# EAGLE design open-bldc (EAGLE 5.03)
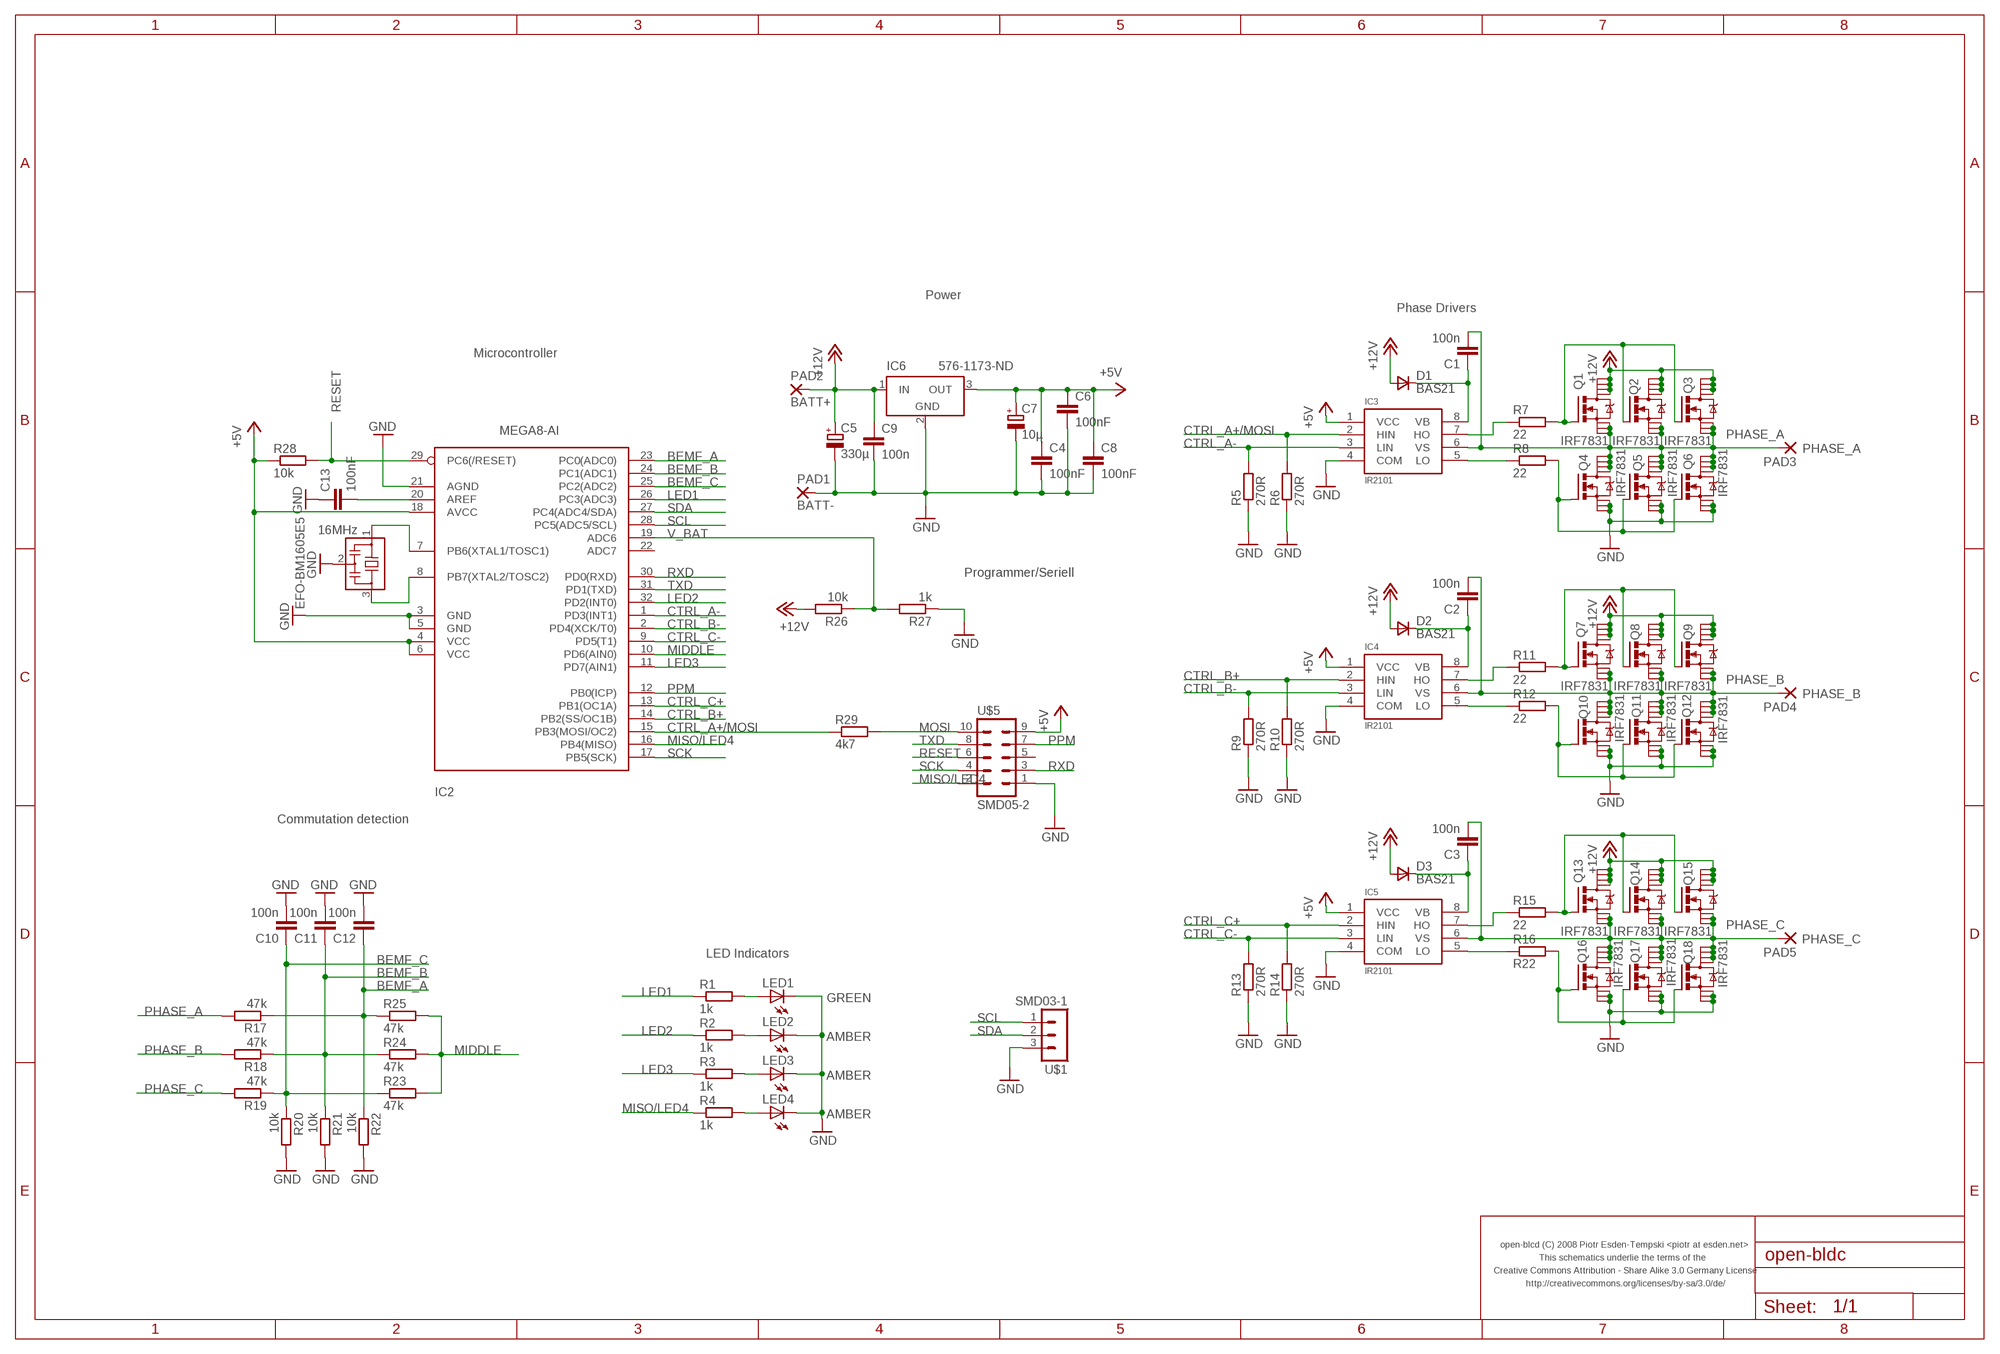
[diagram p0: schematic, sheet 1]

## Parts
C1  100n  C-EUC0603  [C0603]
C2  100n  C-EUC0603  [C0603]
C3  100n  C-EUC0603  [C0603]
C4  100nF  C-EUC0603  [C0603]
C5  330µ  CPOL-EUE3.5-8  [E3,5-8]
C6  100nF  C-EUC0603  [C0603]
C7  10µ  CPOL-EUD/7343-31R  [D/7343-31R]
C8  100nF  C-EUC0603  [C0603]
C9  100n  C-EUC0603  [C0603]
C10  100n  C-EUC0603  [C0603]
C11  100n  C-EUC0603  [C0603]
C12  100n  C-EUC0603  [C0603]
C13  100nF  C-EUC0603  [C0603]
D1  BAS21  VAR2SOT23  [SOT-23]
D2  BAS21  VAR2SOT23  [SOT-23]
D3  BAS21  VAR2SOT23  [SOT-23]
EFO-BM1605E5  16MHz  EFOBM  [EFOBM]
IC2  MEGA8-AI  [TQFP32-08]
IC3  IR2101  [SO-8]
IC4  IR2101  [SO-8]
IC5  IR2101  [SO-8]
IC6  576-1173-ND  LT1129CST5  [SOT223]
LED1  GREEN  LEDCHIP-LED0603  [CHIP-LED0603]
LED2  AMBER  LEDCHIP-LED0603  [CHIP-LED0603]
LED3  AMBER  LEDCHIP-LED0603  [CHIP-LED0603]
LED4  AMBER  LEDCHIP-LED0603  [CHIP-LED0603]
PAD1  BATT-  SMD5  [SMD2,54-5,08]
PAD2  BATT+  SMD5  [SMD2,54-5,08]
PAD3  PHASE_A  SMD5  [SMD2,54-5,08]
PAD4  PHASE_B  SMD5  [SMD2,54-5,08]
PAD5  PHASE_C  SMD5  [SMD2,54-5,08]
Q1  IRF7831  N-MOSFET-SO8S  [SO-08]
Q2  IRF7831  N-MOSFET-SO8S  [SO-08]
Q3  IRF7831  N-MOSFET-SO8S  [SO-08]
Q4  IRF7831  N-MOSFET-SO8S  [SO-08]
Q5  IRF7831  N-MOSFET-SO8S  [SO-08]
Q6  IRF7831  N-MOSFET-SO8S  [SO-08]
Q7  IRF7831  N-MOSFET-SO8S  [SO-08]
Q8  IRF7831  N-MOSFET-SO8S  [SO-08]
Q9  IRF7831  N-MOSFET-SO8S  [SO-08]
Q10  IRF7831  N-MOSFET-SO8S  [SO-08]
Q11  IRF7831  N-MOSFET-SO8S  [SO-08]
Q12  IRF7831  N-MOSFET-SO8S  [SO-08]
Q13  IRF7831  N-MOSFET-SO8S  [SO-08]
Q14  IRF7831  N-MOSFET-SO8S  [SO-08]
Q15  IRF7831  N-MOSFET-SO8S  [SO-08]
Q16  IRF7831  N-MOSFET-SO8S  [SO-08]
Q17  IRF7831  N-MOSFET-SO8S  [SO-08]
Q18  IRF7831  N-MOSFET-SO8S  [SO-08]
R1  1k  R-EU_R0603  [R0603]
R2  1k  R-EU_R0603  [R0603]
R3  1k  R-EU_R0603  [R0603]
R4  1k  R-EU_R0603  [R0603]
R5  270R  R-EU_R0603  [R0603]
R6  270R  R-EU_R0603  [R0603]
R7  22  R-EU_R0603  [R0603]
R8  22  R-EU_R0603  [R0603]
R9  270R  R-EU_R0603  [R0603]
R10  270R  R-EU_R0603  [R0603]
R11  22  R-EU_R0603  [R0603]
R12  22  R-EU_R0603  [R0603]
R13  270R  R-EU_R0603  [R0603]
R14  270R  R-EU_R0603  [R0603]
R15  22  R-EU_R0603  [R0603]
R16  R22  R-EU_R0603  [R0603]
R17  47k  R-EU_R0603  [R0603]
R18  47k  R-EU_R0603  [R0603]
R19  47k  R-EU_R0603  [R0603]
R20  10k  R-EU_R0603  [R0603]
R21  10k  R-EU_R0603  [R0603]
R22  10k  R-EU_R0603  [R0603]
R23  47k  R-EU_R0603  [R0603]
R24  47k  R-EU_R0603  [R0603]
R25  47k  R-EU_R0603  [R0603]
R26  10k  R-EU_R0603  [R0603]
R27  1k  R-EU_R0603  [R0603]
R28  10k  R-EU_R0603  [R0603]
R29  4k7  R-EU_R0603  [R0603]
U$1  SMD03-1  [SMD03-1]
U$5  SMD05-2  [SMD05-2]

## Nets
+5V: C4.1 C6.1 C7.+ C8.1 IC2.4(VCC) IC2.6(VCC) IC2.18(AVCC) IC3.1(VCC) IC4.1(VCC) IC5.1(VCC) IC6.3(OUT) R28.1 U$5.9
+12V: C5.+ C9.1 D1.3(A) D2.3(A) D3.3(A) IC6.1(IN) PAD2.1(P) Q1.5(D) Q1.6(D) Q1.7(D) Q1.8(D) Q2.5(D) Q2.6(D) Q2.7(D) Q2.8(D) Q3.5(D) Q3.6(D) Q3.7(D) Q3.8(D) Q7.5(D) Q7.6(D) Q7.7(D) Q7.8(D) Q8.5(D) Q8.6(D) Q8.7(D) Q8.8(D) Q9.5(D) Q9.6(D) Q9.7(D) Q9.8(D) Q13.5(D) Q13.6(D) Q13.7(D) Q13.8(D) Q14.5(D) Q14.6(D) Q14.7(D) Q14.8(D) Q15.5(D) Q15.6(D) Q15.7(D) Q15.8(D) R26.2
BEMF_A: C12.1 IC2.23(PC0(ADC0)) R17.1 R22.1 R25.1
BEMF_B: C11.1 IC2.24(PC1(ADC1)) R18.1 R21.1 R24.1
BEMF_C: C10.1 IC2.25(PC2(ADC2)) R19.1 R20.1 R23.1
CTRL_A+/MOSI: IC2.15(PB3(MOSI/OC2)) IC3.2(HIN) R6.2 R29.1
CTRL_A-: IC2.1(PD3(INT1)) IC3.3(LIN) R5.2
CTRL_B+: IC2.14(PB2(SS/OC1B)) IC4.2(HIN) R10.2
CTRL_B-: IC2.2(PD4(XCK/T0)) IC4.3(LIN) R9.2
CTRL_C+: IC2.13(PB1(OC1A)) IC5.2(HIN) R14.2
CTRL_C-: IC2.9(PD5(T1)) IC5.3(LIN) R13.2
GND: C4.2 C5.- C6.2 C7.- C8.2 C9.2 C10.2 C11.2 C12.2 C13.1 EFO-BM1605E5.2 IC2.3(GND) IC2.5(GND) IC2.21(AGND) IC3.4(COM) IC4.4(COM) IC5.4(COM) IC6.2(GND) LED1.C LED2.C LED3.C LED4.C PAD1.1(P) Q4.1(S) Q4.2(S) Q4.3(S) Q5.1(S) Q5.2(S) Q5.3(S) Q6.1(S) Q6.2(S) Q6.3(S) Q10.1(S) Q10.2(S) Q10.3(S) Q11.1(S) Q11.2(S) Q11.3(S) Q12.1(S) Q12.2(S) Q12.3(S) Q16.1(S) Q16.2(S) Q16.3(S) Q17.1(S) Q17.2(S) Q17.3(S) Q18.1(S) Q18.2(S) Q18.3(S) R5.1 R6.1 R9.1 R10.1 R13.1 R14.1 R20.2 R21.2 R22.2 R27.1 U$1.3 U$5.1
LED1: IC2.26(PC3(ADC3)) R1.1
LED2: IC2.32(PD2(INT0)) R2.1
LED3: IC2.11(PD7(AIN1)) R3.1
MIDDLE: IC2.10(PD6(AIN0)) R23.2 R24.2 R25.2
MISO/LED4: IC2.16(PB4(MISO)) R4.1 U$5.2
MOSI: R29.2 U$5.10
N$1: IC4.7(HO) R11.1
N$2: IC3.7(HO) R7.1
N$3: LED1.A R1.2
N$4: LED2.A R2.2
N$5: LED3.A R3.2
N$6: C13.2 IC2.20(AREF)
N$7: IC3.5(LO) R8.1
N$8: EFO-BM1605E5.1 IC2.7(PB6(XTAL1/TOSC1))
N$9: EFO-BM1605E5.3 IC2.8(PB7(XTAL2/TOSC2))
N$10: LED4.A R4.2
N$11: Q1.4(G) Q2.4(G) Q3.4(G) R7.2
N$12: C1.1 D1.1(C) IC3.8(VB)
N$13: IC4.5(LO) R12.1
N$14: Q7.4(G) Q8.4(G) Q9.4(G) R11.2
N$15: Q4.4(G) Q5.4(G) Q6.4(G) R8.2
N$16: C2.1 D2.1(C) IC4.8(VB)
N$17: Q10.4(G) Q11.4(G) Q12.4(G) R12.2
N$18: IC5.7(HO) R15.1
N$19: IC5.5(LO) R16.1
N$20: Q13.4(G) Q14.4(G) Q15.4(G) R15.2
N$21: C3.1 D3.1(C) IC5.8(VB)
N$22: Q16.4(G) Q17.4(G) Q18.4(G) R16.2
PHASE_A: C1.2 IC3.6(VS) PAD3.1(P) Q1.1(S) Q1.2(S) Q1.3(S) Q2.1(S) Q2.2(S) Q2.3(S) Q3.1(S) Q3.2(S) Q3.3(S) Q4.5(D) Q4.6(D) Q4.7(D) Q4.8(D) Q5.5(D) Q5.6(D) Q5.7(D) Q5.8(D) Q6.5(D) Q6.6(D) Q6.7(D) Q6.8(D) R17.2
PHASE_B: C2.2 IC4.6(VS) PAD4.1(P) Q7.1(S) Q7.2(S) Q7.3(S) Q8.1(S) Q8.2(S) Q8.3(S) Q9.1(S) Q9.2(S) Q9.3(S) Q10.5(D) Q10.6(D) Q10.7(D) Q10.8(D) Q11.5(D) Q11.6(D) Q11.7(D) Q11.8(D) Q12.5(D) Q12.6(D) Q12.7(D) Q12.8(D) R18.2
PHASE_C: C3.2 IC5.6(VS) PAD5.1(P) Q13.1(S) Q13.2(S) Q13.3(S) Q14.1(S) Q14.2(S) Q14.3(S) Q15.1(S) Q15.2(S) Q15.3(S) Q16.5(D) Q16.6(D) Q16.7(D) Q16.8(D) Q17.5(D) Q17.6(D) Q17.7(D) Q17.8(D) Q18.5(D) Q18.6(D) Q18.7(D) Q18.8(D) R19.2
PPM: IC2.12(PB0(ICP)) U$5.7
RESET: IC2.29(PC6(/RESET)) R28.2 U$5.6
RXD: IC2.30(PD0(RXD)) U$5.3
SCK: IC2.17(PB5(SCK)) U$5.4
SCL: IC2.28(PC5(ADC5/SCL)) U$1.1
SDA: IC2.27(PC4(ADC4/SDA)) U$1.2
TXD: IC2.31(PD1(TXD)) U$5.8
V_BAT: IC2.19(ADC6) R26.1 R27.2
Unconnected: IC2.22(ADC7) U$5.5

## Notes on the sheet
- Power
- Phase Drivers
- Microcontroller
- Programmer/Seriell
- Commutation detection
- LED Indicators
- open-blcd (C) 2008 Piotr Esden-Tempski <piotr at esden.net>
- This schematics underlie the terms of the
- Creative Commons Attribution - Share Alike 3.0 Germany License
- http://creativecommons.org/licenses/by-sa/3.0/de/

## Power pins joined to a net without a drawn wire
GND: IC6.4(GND)

## Library data of the parts
C1-C4 C6 C8-C13 = rcl:C-EU: CAPACITOR, European symbol
C5 C7 = rcl:CPOL-EU: POLARIZED CAPACITOR, European symbol
D1-D3 = zetex:VAR2SOT23: DIODE
EFO-BM1605E5 = open-bldc:EFOBM
IC2 = atmel:MEGA8: MICROCONTROLLER 8 Kbytes FLASH, 1 kbytes SRAM, 512 bytes EEPROM, USART, 6-channel 10 bit ADC, 2-channel 8 bit ADC Pin compatible with Atmega48, ATMega88, ATMega168 Source: avr.lbr
IC3-IC5 = open-bldc:IR2101
IC6 = linear-technology:LT1129CST5: VOLTAGE REGULATOR with shutdown
LED1-LED4 = led:LED: LED OSRAM: - CHIPLED LG R971, LG N971, LY N971, LG Q971, LY Q971, LO R971, LY R971 LH N974, LH R974 LS Q976, LO Q976, LY Q976 LO Q996 - Hyper CHIPLED LW Q18S LB Q993, LB Q99A, LB R99A - SideLED LS A670, LO A670, LY A670, LG A670, LP A670 LB A673, LV A673, LT A673, LW A673 LH A674 LY A675 LS A676, LA A676, LO A676, LY A676, LW A676 LS A679, LY A679, LG A679 - Hyper Micro SIDELED® LS Y876, LA Y876, LO Y876, LY Y876 LT Y87S - SmartLED LW L88C, LW L88S LB L89C, LB L89S, LG L890 LS L89K, LO L89K, LY L89K LS L896, LA L896, LO L896, LY L896 - TOPLED LS T670, LO T670, LY T670, LG T670, LP T670 LSG T670, LSP T670, LSY T670, LOP T670, LYG T670 LG T671, LOG T671, LSG T671 LB T673, LV T673, LT T673, LW T673 LH T674 LS T676, LA T676, LO T676, LY T676, LB T676, LH T676, LSB T676, LW T676 LB T67C, LV T67C, LT T67C, LS T67K, LO T67K, LY T67K, LW E67C LS E67B, LA E67B, LO E67B, LY E67B, LB E67C, LV E67C, LT E67C LW T67C LS T679, LY T679, LG T679 LS T770, LO T770, LY T770, LG T770, LP T770 LB T773, LV T773, LT T773, LW T773 LH T774 LS E675, LA E675, LY E675, LS T675 LS T776, LA T776, LO T776, LY T776, LB T776 LHGB T686 LT T68C, LB T68C - Hyper Mini TOPLED® LB M676 - Mini TOPLED Santana® LG M470 LS M47K, LO M47K, LY M47K Source: http://www.osram.convergy.de LUXEON: - LUMILED® LXK2-PW12-R00, LXK2-PW12-S00, LXK2-PW14-U00, LXK2-PW14-V00 LXK2-PM12-R00, LXK2-PM12-S00, LXK2-PM14-U00 LXK2-PE12-Q00, LXK2-PE12-R00, LXK2-PE12-S00, LXK2-PE14-T00, LXK2-PE14-U00 LXK2-PB12-K00, LXK2-PB12-L00, LXK2-PB12-M00, LXK2-PB14-N00, LXK2-PB14-P00, LXK2-PB14-Q00 LXK2-PR12-L00, LXK2-PR12-M00, LXK2-PR14-Q00, LXK2-PR14-R00 LXK2-PD12-Q00, LXK2-PD12-R00, LXK2-PD12-S00 LXK2-PH12-R00, LXK2-PH12-S00 LXK2-PL12-P00, LXK2-PL12-Q00, LXK2-PL12-R00 Source: www.luxeon.com KINGBRIGHT: KA-3528ASYC Source: www.kingbright.com
PAD1-PAD5 = wirepad:SMD5: SMD PAD
Q1-Q18 = my-transistor-power:N-MOSFET-SO8: N-Channel MOSFET Example: FDS7760A; N-Channel Logic Level PowerTrench® MOSFET FDS2572; N-Channel UltraFET® Trench MOSFET Source: www.fairchildsemi.com
R1-R29 = rcl:R-EU_: RESISTOR, European symbol
U$1 = patrick:SMD03-1
U$5 = patrick:SMD05-2

## Net classes
0 default: width 0.152 mm, drill 0.305 mm, clearance 0.152 mm

## Board
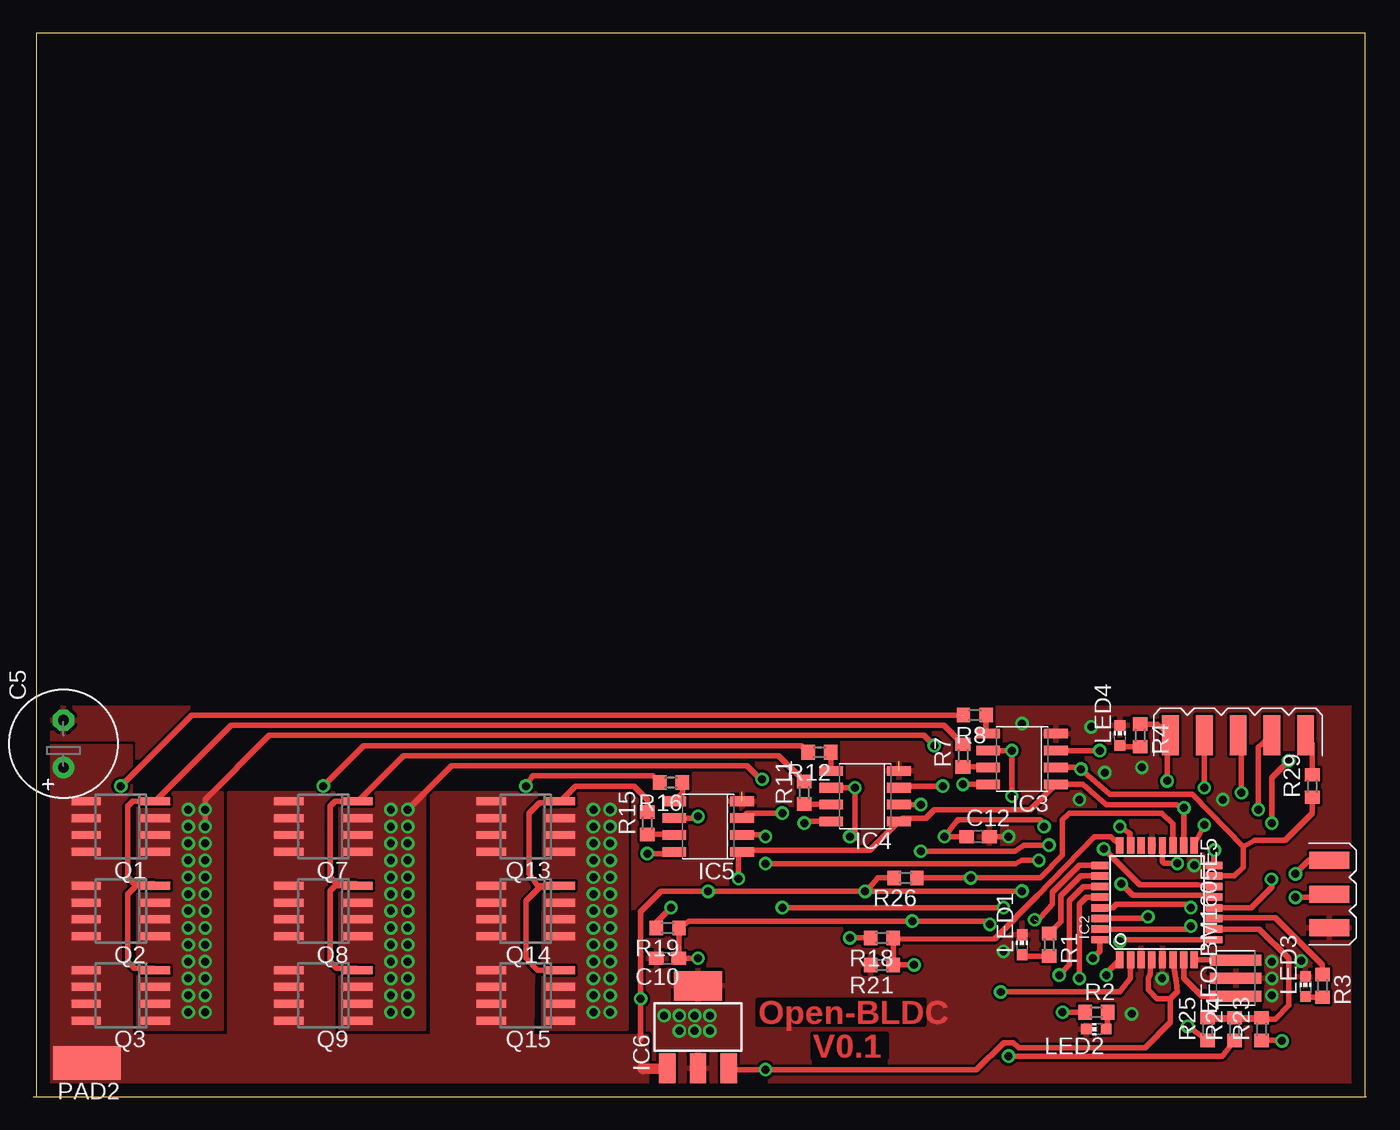
[diagram p1: board, top side]
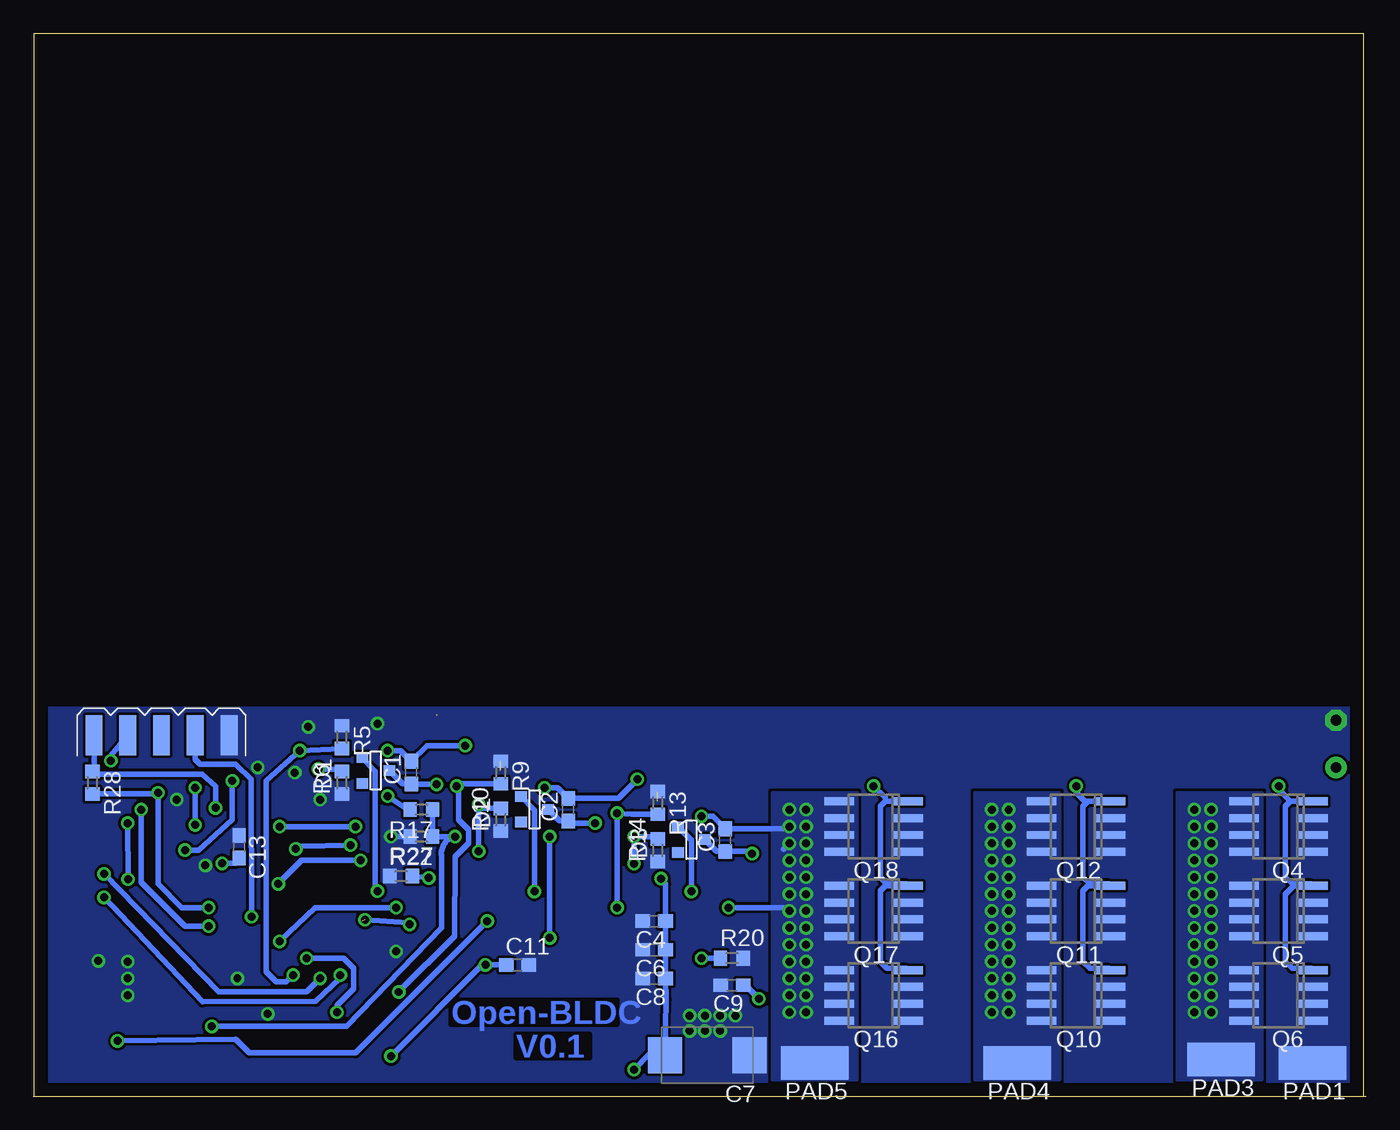
[diagram p2: board, bottom side, seen from below]

Size 100.32 x 80 mm. Coordinates in mm from the lower left corner, seen from the top.
Outline: 100.24,0 100.24,80 0.24,80 0.24,0
Outline: 0,0 100.32,0
Copper layers (1*16): Top 0.035mm / dielectric 1.5mm / Bottom 0.035mm
Design rules "default *": minimum track width 10mil, minimum drill 23mil, track to track 8mil, track to pad 8mil, pad to pad 8mil, via to via 8mil, smd to smd 8mil, copper to edge 40mil, drill to drill 8mil, minimum pad ring 10mil, minimum via ring 8mil, stop-mask expansion 0mil, vias tented up to drill 0mil, thermal gap 10mil

### Footprints (pad centres in the part's own frame; a part is rotated, then mirrored left to right if it is on the bottom)
C0603 = smd 1.1 x 1: 1 -0.85,0; 2 0.85,0
E3,5-8 = drill 0.813 pad 1.6 round: + -1.778,0 | drill 0.813 pad 1.6 octagon: - 1.778,0
D/7343-31R = smd 2.55 x 2.7: + 3.175,0; - -3.175,0
SOT-23 = smd 0.787 x 0.889: 1 0.025,-1.016; 2 -0.94,1.016; 3 0.991,1.016
EFOBM = smd 0.8 x 3.9: 1 0.7,1.45; 2 2.05,1.45; 3 3.4,1.45
TQFP32-08 = smd 1.27 x 0.559: 1 -4.293,2.8; 2 -4.293,2; 3 -4.293,1.2; 4 -4.293,0.4; 5 -4.293,-0.4; 6 -4.293,-1.2; 7 -4.293,-2; 8 -4.293,-2.8; 17 4.293,-2.8; 18 4.293,-2; 19 4.293,-1.2; 20 4.293,-0.4; 21 4.293,0.4; 22 4.293,1.2; 23 4.293,2; 24 4.293,2.8 | smd 0.559 x 1.27: 9 -2.8,-4.293; 10 -2,-4.293; 11 -1.2,-4.293; 12 -0.4,-4.293; 13 0.4,-4.293; 14 1.2,-4.293; 15 2,-4.293; 16 2.8,-4.293; 25 2.8,4.293; 26 2,4.293; 27 1.2,4.293; 28 0.4,4.293; 29 -0.4,4.293; 30 -1.2,4.293; 31 -2,4.293; 32 -2.8,4.293
SO-8 = smd 0.72 x 1.78: 1 -1.905,-2.543; 2 -0.635,-2.543; 3 0.635,-2.543; 4 1.905,-2.543; 5 1.905,2.543; 6 0.635,2.543; 7 -0.635,2.543; 8 -1.905,2.543
SOT223 = smd 1.219 x 2.235: 1 -2.311,-3.099; 2 0,-3.099; 3 2.311,-3.099 | smd 3.6 x 2.2: 4 0,3.099
CHIP-LED0603 = smd 0.8 x 0.8: A 0,-0.75; C 0,0.75
SMD2,54-5,08 = smd 2.54 x 5.08: 1 0,0
SO-08 = smd 0.6 x 2.2: 1 -1.905,-2.6; 2 -0.635,-2.6; 3 0.635,-2.6; 4 1.905,-2.6; 5 1.905,2.6; 6 0.635,2.6; 7 -0.635,2.6; 8 -1.905,2.6
R0603 = smd 1 x 1.1: 1 -0.85,0; 2 0.85,0
SMD03-1 = smd 1.27 x 3: 1 1.27,1.524; 2 3.81,1.524; 3 6.35,1.524
SMD05-2 = smd 1.27 x 3 bottom: 1 1.27,1.524; 3 3.81,1.524; 5 6.35,1.524; 7 8.89,1.524; 9 11.43,1.524 | smd 1.27 x 3: 2 1.27,1.524; 4 3.81,1.524; 6 6.35,1.524; 8 8.89,1.524; 10 11.43,1.524

### Placement (x,y rotation side)
C1  71.87,24.38 90 bottom
C2  60.06,21.59 90 bottom
C3  48.25,19.3 90 bottom
C4  53.58,13.21 180 bottom
C5  2.28,26.54 90 top
C6  53.58,11.05 180 bottom
C7  49.6,3.12 180 bottom
C8  53.58,8.89 180 bottom
C9  47.74,8.38 180 bottom
C10  47.74,10.41 180 top
C11  63.87,9.91 0 bottom
C12  71.11,19.56 0 top
C13  84.83,18.8 270 bottom
D1  74.54,24.51 90 bottom
D2  62.6,21.59 90 bottom
D3  50.79,19.3 90 bottom
EFO-BM1605E5  91.94,6.86 90 top
IC2  84.57,14.61 90 top
IC3  74.41,25.4 90 top
IC4  62.6,22.61 90 top
IC5  50.79,20.32 90 top
IC6  50.03,5.23 0 top
LED1  74.41,11.43 0 top
LED2  80,5.08 90 top
LED3  95.75,8.28 0 top
LED4  81.78,27.18 0 top
PAD1  4.05,2.54 90 bottom
PAD2  4.05,2.54 90 top
PAD3  10.91,2.79 90 bottom
PAD4  26.28,2.54 90 bottom
PAD5  41.52,2.54 90 bottom
Q1  6.59,20.32 90 top
Q2  6.59,13.97 90 top
Q3  6.59,7.62 90 top
Q4  6.59,20.32 90 bottom
Q5  6.59,13.97 90 bottom
Q6  6.59,7.62 90 bottom
Q7  21.83,20.32 90 top
Q8  21.83,13.97 90 top
Q9  21.83,7.62 90 top
Q10  21.83,7.62 90 bottom
Q11  21.83,13.97 90 bottom
Q12  21.83,20.32 90 bottom
Q13  37.07,20.32 90 top
Q14  37.07,13.97 90 top
Q15  37.07,7.62 90 top
Q16  37.07,7.62 90 bottom
Q17  37.07,13.97 90 bottom
Q18  37.07,20.32 90 bottom
R1  76.44,11.43 270 top
R2  80,6.35 0 top
R3  97.02,8.33 270 top
R4  83.3,27.18 270 top
R5  77.08,27.05 270 bottom
R6  77.08,23.62 90 bottom
R7  69.97,25.65 90 top
R8  70.86,28.7 180 top
R9  65.14,24.38 270 bottom
R10  65.14,20.83 90 bottom
R11  58.03,22.86 90 top
R12  59.17,25.91 180 top
R13  53.33,22.1 270 bottom
R14  53.33,18.54 90 bottom
R15  46.22,20.57 90 top
R16  48,23.62 180 top
R17  71.11,21.59 180 bottom
R18  63.87,11.94 180 top
R19  47.74,12.7 180 top
R20  47.74,10.41 0 bottom
R21  63.87,9.91 180 top
R22  71.11,19.56 180 bottom
R23  92.45,5.08 90 top
R24  90.41,5.08 90 top
R25  88.38,5.08 90 top
R26  65.65,16.46 180 top
R27  72.63,16.59 0 bottom
R28  95.88,23.62 270 bottom
R29  96.26,23.37 90 top
U$1  96,19.05 270 top
U$5  84.32,25.65 0 top

### Tracks (layer width: path | path; a pad name or v marks a point on that pad's centre or on a via)
+5V  (via drill 0.6)
  Top 0.406: IC2.18 86.6,18.93 v86.6,21.72 85.97,21.97 80.76,21.97 78.98,23.5 IC3.1 75.05,21.59 67.81,21.59 67.17,20.95 65.39,20.95 IC4.1 62.98,18.54 53.46,18.54 IC5.1 53.08,18.16 v53.08,16.41 | IC2.6 85.87,9.49 86.02,8.64 86.1,7.87 85.59,7.37 | IC2.4 84.06,10.2 84.06,9.27 83.91,8.87 83.91,8.05 84.57,7.37 85.59,7.37 | IC6.3 52.42,2.03 v55.11,2.03 70.98,2.03 73.04,4.06 73.78,4.06 74.18,3.68 83.68,3.68 85.59,5.59 85.59,7.37
  Bottom 0.406: v86.6,21.72 86.6,23.37 87.62,24.26 95.49,24.26 95.75,24.38 | 95.75,24.38 U$5.9 | v55.11,2.03 53.96,3.17 C7.+ 52.7,7.33 C8.1 C6.1 C4.1 52.73,16.01 52.82,16.13 v53.08,16.41 | 95.75,24.38 95.79,24.38 R28.1
+12V  (via drill 0.6)
  Top 0.406: 45.71,4.32 v45.71,7.37 45.71,13.92 47.23,15.44 v50.79,15.44 v62.6,15.44 | v62.6,15.44 v74.41,15.47 | 45.89,2.11 45.71,2.29 | v62.6,15.44 62.89,15.49 62.89,15.66 63.57,16.46 R26.2
  Top 0.813: 45.89,2.11 IC6.1
  Bottom 0.406: D3.3 50.79,19.28 v50.79,15.44 | D2.3 62.6,21.57 v62.6,15.44 62.6,15.11 | D1.3 74.59,24.49 74.59,15.62 v74.41,15.47 | C9.1 46.73,8.38 v45.71,7.37
  pour Top (no thermals): 37.84,22.86 29.96,22.86 29.96,4.57 22.6,4.57 22.6,22.86 14.72,22.86 14.72,4.57 7.36,4.57 7.36,26.42 0.24,26.42 0.24,0 46.22,0 46.22,4.57 37.58,4.57
BEMF_A  (via drill 0.6)
  Top 0.406: C12.1 v68.57,19.56 69.59,20.83 75.81,20.83 v76.06,20.32 | IC2.23 82.54,18.93 82.54,19.81 v81.78,20.32 | R25.1 88.34,4.23 v86.88,5.28
  Bottom 0.406: R17.1 C12.1 v68.57,19.56 arc-90 69.59,18.03 69.59,12.7 76.72,5.31 v86.88,5.28 | v76.06,20.32 v81.78,20.32
BEMF_B  (via drill 0.6)
  Top 0.406: v66.28,9.91 C11.1 R18.1 64.73,11.92 64.73,11.84 72.36,11.86 75.56,15.11 79.87,19.56 81.11,19.56 IC2.24 | R24.1 89.49,3.05 v73.4,3.05
  Bottom 0.406: C11.1 v66.28,9.91 66.54,9.91 v73.4,3.05
BEMF_C  (via drill 0.6)  (1 unrouted)
  Top 0.406: IC2.25 78.74,17.41 76.7,15.37 76.7,14.48 75.56,13.21 | v50.03,10.41 C10.1 R19.1 49.35,13.21 v66.16,13.21 72,13.21 v72,12.95 | R23.1 93.88,4.23 v93.97,4.19
  Bottom 0.406: v50.03,10.41 C10.1 | v93.97,4.19 85.08,4.32 84.06,3.3 76.06,3.3 v66.16,13.21 | v75.35,13.31 72.13,13.08 v72,12.95
CTRL_A+/MOSI  (via drill 0.6)
  Top 0.406: IC3.2 78.6,24.77 v78.86,24.64 81.02,22.73 87.24,22.73 91.05,18.8 | 91.05,18.8 91.05,17.27 90.38,16.61 IC2.15 | R29.1 96.26,21.34 94.22,19.3 91.94,19.3 91.05,18.8
  Bottom 0.406: v78.86,24.64 77.25,24.64 R6.2
CTRL_A-  (via drill 0.6)
  Top 0.406: v80.25,26.04 IC3.3 | v80.76,9.14 80.76,9.3 IC2.1
  Bottom 0.406: R5.2 77.12,26.16 v80.25,26.04 82.79,23.75 82.79,9.4 82.03,8.64 81.27,8.64 v80.76,9.14
CTRL_B+  (via drill 0.6)
  Top 0.406: v66.79,21.97 IC4.2 | v80.56,18.64 83.3,15.93 87.62,15.95 IC2.14 | v76.44,18.92 74.56,18.92 73.88,18.47 v66.79,18.47
  Bottom 0.406: R10.2 66.5,21.68 v66.79,21.97 v66.79,18.47 | v76.44,18.92 80.24,18.85 v80.56,18.64
CTRL_B-  (via drill 0.6)
  Top 0.406: IC4.3 65.27,23.37 v68.44,23.37 | IC2.2 82.57,8.92 81.78,7.87 v72.81,7.87
  Bottom 0.406: R9.2 68.28,23.53 v68.44,23.37 68.32,23.24 68.32,20.83 67.55,20.07 67.55,19.05 68.57,18.03 68.59,12.06 v72.81,7.87
CTRL_C+  (via drill 0.6)
  Top 0.406: IC5.2 54.98,19.68 v55.11,19.56 | IC2.13 88.36,15.01 87.98,15.16 82.75,15.16 v81.88,16 | v75.68,17.78 74.41,17.78 73.9,17.53 v55.11,17.53
  Bottom 0.406: R14.2 53.5,19.56 v55.11,19.56 v55.11,17.53 | v81.88,16 80.13,17.78 v75.68,17.78
CTRL_C-  (via drill 0.6)
  Top 0.406: v56.38,21.34 53.71,21.34 IC5.3 | IC2.9 81.9,11.8 v81.78,11.68 | v56.38,14.22 v73.02,14.22
  Bottom 0.406: R13.2 55.27,21.25 v56.38,21.34 v56.38,14.22 | v81.78,11.68 79.11,14.22 v73.02,14.22
GND  (via drill 0.6)  (2 unrouted)
  Top 0.406: C12.2 v73.4,19.56
  Bottom 0.406: v73.4,19.56 C12.2
  other vias: 84.95,8.89 95.42,10.21 93.21,10.16 93.21,8.89 93.21,7.62 87.37,17.4 78.73,22.35 73.02,10.92 82.67,6.22 80.64,24.38 47.49,6.1 48.63,6.1 49.77,6.1 50.92,6.1 48.63,4.95 49.77,4.95 50.92,4.95 89.53,22.35 83.43,24.77 79.62,27.81 74.41,28.07
  pour Bottom (rank 2, no thermals): 0.24,0 0.5,29.21 99.56,29.21 99.3,0
  pour Top (rank 2): 0.5,29.21 99.3,29.21 99.3,0 0.5,0
LED1
  Top 0.406: IC2.26 78.83,16.61 77.33,15.11 77.33,13.17 R1.1
LED2  (via drill 0.6)
  Top 0.406: IC2.32 80.28,10.95 v79.75,10.41 | v77.46,6.35 R2.1
  Bottom 0.406: v79.75,10.41 76.95,10.41 76.19,9.65 76.19,8.13 77.46,6.86 v77.46,6.35
LED3
  Top 0.406: R3.1 97.02,9.91 93.46,13.46 88.92,13.46 IC2.11
MIDDLE
  Top 0.406: IC2.10 92.29,12.61 94.48,10.41 94.48,6.86 93.46,5.84 88.72,5.84 R23.2 R24.2 R25.2
MISO/LED4  (via drill 0.6)
  Top 0.406: IC2.16 88.86,18.06 v88.89,18.54 | v85.33,23.75 85.33,26.8 U$5.2 84.61,28.03 R4.1
  Bottom 0.406: v88.89,18.54 87.87,18.54 85.33,20.83 v85.33,23.75
MOSI
  Top 0.406: R29.2 96.26,26.54 U$5.10
N$1
  Top 0.406: R11.1 60.02,22.01 IC4.7
N$2
  Top 0.406: R7.1 71.83,24.8 IC3.7
N$3
  Top 0.406: R1.2 74.51,10.58 LED1.A
N$4
  Top 0.406: R2.2 80.85,5.18 LED2.A
N$5
  Top 0.406: R3.2 95.85,7.48 LED3.A
N$6  (via drill 0.6)
  Top 0.406: v86.1,17.55 85.13,17.55 84.97,17.71 IC2.20
  Bottom 0.406: C13.2 84.83,17.78 85.06,17.55 v86.1,17.55
N$7
  Top 0.406: R8.1 71.71,27.47 IC3.5
N$8
  Top 0.406: EFO-BM1605E5.1 87.94,7.56 86.6,8.89 86.6,10.28 IC2.7
N$9
  Top 0.406: EFO-BM1605E5.3 90.43,10.31 IC2.8
N$10
  Top 0.406: R4.2 81.62,26.33 LED4.A
N$11
  Top 0.406: Q3.4 9.07,9.65 7.61,9.65 7.1,10.16 7.1,15.24 7.74,15.88 Q2.4 9.07,16 7.61,16 7.1,16.51 7.1,21.84 7.48,22.23 Q1.4 14.91,27.94 68.53,27.94 R7.2
N$12  (via drill 0.6)
  Top 0.406: v69.97,23.5 IC3.8
  Bottom 0.406: D1.1 72.52,23.53 C1.1 71.83,23.5 v69.97,23.5
N$13
  Top 0.406: R12.1 60.02,24.55 IC4.5
N$14
  Top 0.406: Q9.4 24.31,9.65 22.85,9.65 22.34,10.16 22.34,15.49 22.72,15.88 Q8.4 24.31,16 22.85,16 22.34,16.51 22.34,21.84 22.72,22.23 Q7.4 27.86,25.65 56.09,25.65 R11.2
N$15  (via drill 0.6)  (1 unrouted)
  Top 0.406: v6.59,23.37 11.93,28.7 69.93,28.7
  Bottom 0.406: 5.71,22.23 Q4.4 | 5.71,22.23 6.09,21.84 6.09,16.51 5.58,16 4.12,16 Q5.4 5.45,15.88 6.09,15.24 6.09,10.16 5.58,9.65 4.12,9.65 Q6.4 | 5.71,22.23 6.59,23.11 v6.59,23.37
N$16  (via drill 0.6)
  Top 0.406: v58.03,20.57 58.16,20.7 IC4.8
  Bottom 0.406: v58.03,20.57 59.9,20.57 C2.1 60.71,20.74 D2.1
N$17  (via drill 0.6)
  Top 0.406: v21.83,23.37 24.88,26.42 57.81,26.42 R12.2
  Bottom 0.406: Q12.4 20.95,22.23 21.07,22.1 | 21.07,22.1 21.33,21.84 21.33,16.51 20.82,16 19.36,16 Q11.4 20.95,15.88 21.33,15.49 21.33,10.16 20.82,9.65 19.36,9.65 Q10.4 | 21.07,22.1 21.83,22.86 v21.83,23.37
N$18
  Top 0.406: R15.1 48.25,19.72 IC5.7
N$19
  Top 0.406: R16.1 48.85,22.82 IC5.5
N$20
  Top 0.406: Q15.4 37.96,9.53 37.07,10.41 37.07,14.73 38.09,15.75 39.55,15.75 Q14.4 37.96,15.88 37.33,16.76 37.33,21.34 38.09,22.1 39.55,22.1 Q13.4 40.82,23.37 45.2,23.37 46.22,22.35 R15.2
N$21  (via drill 0.6)
  Top 0.406: IC5.8 48.12,18.29 v46.22,18.29
  Bottom 0.406: v46.22,18.29 46.38,18.45 C3.1 48.9,18.45 D3.1
N$22  (via drill 0.6)
  Top 0.406: v37.07,23.37 37.58,24.13 46.64,24.13 R16.2
  Bottom 0.406: 36.19,22.23 Q18.4 | 36.19,22.23 36.57,21.84 36.57,16.51 36.06,16 34.6,16 Q17.4 36.19,15.88 36.57,15.49 36.57,10.16 36.06,9.65 34.6,9.65 Q16.4 | 36.19,22.23 36.19,22.48 v37.07,23.37
PHASE_A  (via drill 0.6)
  Top 0.406: v73.65,26.04 IC3.6 | v12.94,20.32 12.94,22.35 17.77,27.18 67.05,27.18 v67.81,26.42 | v73.65,26.04 73.69,26 | v73.65,26.04 v73.65,22.61
  Bottom 0.406: v73.65,26.04 72.67,26.04 C1.2 70.69,26.42 v67.81,26.42 | R17.2 72.13,21.59 v73.65,22.61
  other vias: 11.67,6.35 12.94,6.35 12.94,7.62 11.67,7.62 11.67,8.89 11.67,10.16 11.67,11.43 11.67,12.7 11.67,13.97 11.67,15.24 11.67,16.51 11.67,17.78 11.67,19.05 11.67,20.32 11.67,21.59 12.94,8.89 12.94,10.16 12.94,11.43 12.94,12.7 12.94,13.97 12.94,15.24 12.94,16.51 12.94,17.78 12.94,19.05 12.94,21.59
  pour Top (no thermals): 7.86,22.86 14.21,22.86 14.21,5.08 7.86,5.08
  pour Bottom (no thermals): 7.86,22.86 14.21,22.86 14.21,1.27 7.86,1.27
PHASE_B  (via drill 0.6)
  Top 0.406: v28.18,21.59 31.49,24.89 53.71,24.89 54.73,23.88 v54.85,23.88 | IC4.6 v61.84,23.24 61.84,19.43 v61.46,19.56 | v61.46,11.94 R18.2
  Bottom 0.406: v61.84,23.24 60.86,23.24 C2.2 56.29,22.44 v54.85,23.88 | v61.46,19.56 v61.46,11.94
  other vias: 26.91,6.35 28.18,6.35 28.18,7.62 28.18,8.89 28.18,10.16 28.18,11.43 28.18,12.7 28.18,13.97 28.18,15.24 28.18,16.51 28.18,17.78 28.18,19.05 28.18,20.32 26.91,7.62 26.91,8.89 26.91,10.16 26.91,11.43 26.91,12.7 26.91,13.97 26.91,15.24 26.91,16.51 26.91,17.78 26.91,19.05 26.91,20.32 26.91,21.59
  pour Top (no thermals): 23.1,22.86 29.45,22.86 29.45,5.08 23.1,5.08
  pour Bottom (no thermals): 23.1,22.86 29.45,22.86 29.45,1.27 23.1,1.27
PHASE_C  (via drill 0.6)
  Top 0.406: v50.03,21.08 49.9,20.95 IC5.6 | R19.2 46.89,13.12 v48,14.22
  Bottom 0.406: v50.03,21.08 49.18,21.08 C3.2 43.59,20.15 v43.42,20.32 | v43.42,19.05 43.84,18.63 | v48,14.22 43.68,14.22 v43.42,13.97
  other vias: 42.15,6.35 43.42,6.35 43.42,7.62 43.42,8.89 43.42,10.16 43.42,11.43 43.42,12.7 43.42,15.24 43.42,16.51 43.42,17.78 42.15,7.62 42.15,8.89 42.15,10.16 42.15,11.43 42.15,12.7 42.15,13.97 42.15,15.24 42.15,16.51 42.15,17.78 42.15,19.05 42.15,20.32 42.15,21.59 43.42,21.59
  pour Top (no thermals): 38.45,22.86 44.69,22.86 44.69,5.08 38.34,5.08
  pour Bottom (no thermals): 38.34,22.86 44.69,22.86 44.69,1.27 38.34,1.27
PPM  (via drill 0.6)
  Top 0.406: IC2.12 91.67,14.21 93.21,15.75 v93.18,16.36 | v93.21,20.57 93.21,24 v94.48,25.27
  Bottom 0.406: v94.48,25.27 94.48,25.65 U$5.7 | v93.18,16.36 v93.21,20.57
RESET  (via drill 0.6)
  Top 0.406: IC2.29 81.25,14.21 81.52,14.48 86.86,14.48 v87.11,14.22 | v87.11,14.22 87.09,14.21 v87.11,14.22 | v90.92,22.86 90.92,26.8 U$5.6
  Bottom 0.406: v87.11,14.22 89.14,14.22 90.92,16 v90.92,22.86 91.01,22.77 R28.2
RXD  (via drill 0.6)
  Top 0.406: IC2.30 83.5,13.4 v83.89,13.54
  Bottom 0.406: v83.89,13.54 83.94,23.88 85.08,25.02 87.75,25.02 88.13,25.4 U$5.3
SCK  (via drill 0.6)
  Top 0.406: IC2.17 v88.13,20.45 | v88.13,23.24 U$5.4
  Bottom 0.406: v88.13,20.45 v88.13,23.24
SCL  (via drill 0.6)
  Top 0.406: IC2.28 79.26,15.01 78.73,14.48 v78.73,8.89 | v94.99,16.76 96,17.78 U$1.1
  Bottom 0.406: v78.73,8.89 79.75,7.87 86.35,7.87 v94.99,16.76
SDA  (via drill 0.6)
  Top 0.406: IC2.27 79.04,15.8 77.97,14.73 77.97,9.91 v77.21,9.14 | v94.99,14.99 97.27,14.99 U$1.2
  Bottom 0.406: v77.21,9.14 77.21,8.89 79.06,7.16 87.57,7.14 v94.99,14.99
TXD  (via drill 0.6)
  Top 0.406: IC2.31 87.02,12.61 v87.11,12.83 | v92.19,21.59 92.19,26.29 U$5.8
  Bottom 0.406: v87.11,12.83 88.89,12.83 92.19,16.13 v92.19,21.59
V_BAT  (via drill 0.6)
  Top 0.406: R26.1 v70.55,16.46 75.78,16.46 77.46,18.16 77.46,20.83 77.97,21.34 84.95,21.34 85.77,20.52 IC2.19
  Bottom 0.406: v70.55,16.46 R27.2

### Text on the board
Top: Open-BLDC | V0.1
Bottom: Open-BLDC | V0.1
tStop: Open-BLDC | V0.1
bStop: Open-BLDC | V0.1